# Altium schematic sheet MCU.SchDoc: MCU
size A4; Author: -; CompanyName: IOElectro; DrawnBy: Esmaeill M; Engineer: -; Organization: IOElectro; Address1: Bushehr,Iran; Address2: www.ioelectro.ir; DocumentNumber: 4; Revision: v0.1; SheetNumber: 4; SheetTotal: 4; ProjectNumber: 1013; Note: MCU

## Notes on the sheet
- Title
- Size:
- Date:
- A4
- Project Number:
- Time:
- Revision:
- Sheet
- of
- Drawn By:
- IOElectro
- File:
- Note: